# EAGLE design PowerAdapterBoard (EAGLE 6.3)
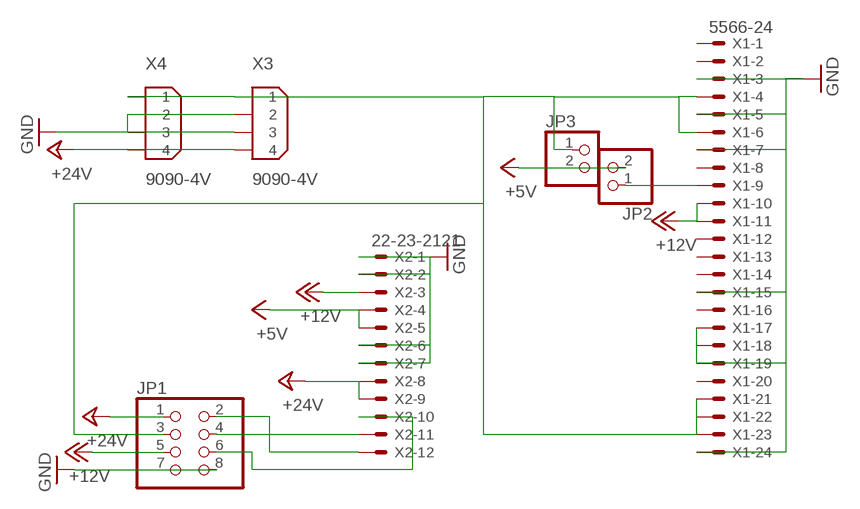
[diagram p0: schematic, sheet 1]

## Parts
JP1  PINHD-2X4  [2X04]
JP2  PINHD-1X2  [1X02]
JP3  PINHD-1X2  [1X02]
X1  5566-24  [5566-24]
X2  22-23-2121  [22-23-2121]
X3  9090-4V  [9090-4V]
X4  9090-4V  [9090-4V]

## Nets
+5V: JP2.2 JP3.2 X2.4 X2.5
+12V: JP1.5 X1.10 X1.11 X2.3
+24V: JP1.1 X2.8 X2.9 X3.4 X4.4
GND: JP1.7 JP1.8 X1.3 X1.5 X1.7 X1.15 X1.17 X1.18 X1.19 X1.24 X2.1 X2.2 X2.6 X2.7 X3.2 X3.3 X4.2 X4.3
N$1: JP1.6 X2.10
N$2: JP1.4 X2.11
N$3: JP1.2 X2.12
N$4: JP2.1 X1.9
N$5: JP1.3 JP3.1 X1.4 X1.6 X1.21 X1.22 X1.23 X3.1 X4.1
Unconnected: X1.1 X1.2 X1.8 X1.12 X1.13 X1.14 X1.16 X1.20

## Library data of the parts
JP1 = pinhead:PINHD-2X4: PIN HEADER
JP2 JP3 = pinhead:PINHD-1X2: PIN HEADER
X1 = con-molex:5566-24: Mini FIT connector 24 pol Source: http://www.molex.com; OC_FARNELL: unknown; OC_NEWARK: unknown
X2 = con-molex:22-23-2121: .100" (2.54mm) Center Header - 12 Pin; MF: MOLEX; MPN: 22-23-2121; OC_FARNELL: 1462935; OC_NEWARK: 56H0456
X3 X4 = con-thomas-betts:9090-4: Disk Drive Power four position Source: Thomas & Betts Electronic Interconnects Eiropean Edition 1998; OC_FARNELL: unknown; OC_NEWARK: unknown

## Board
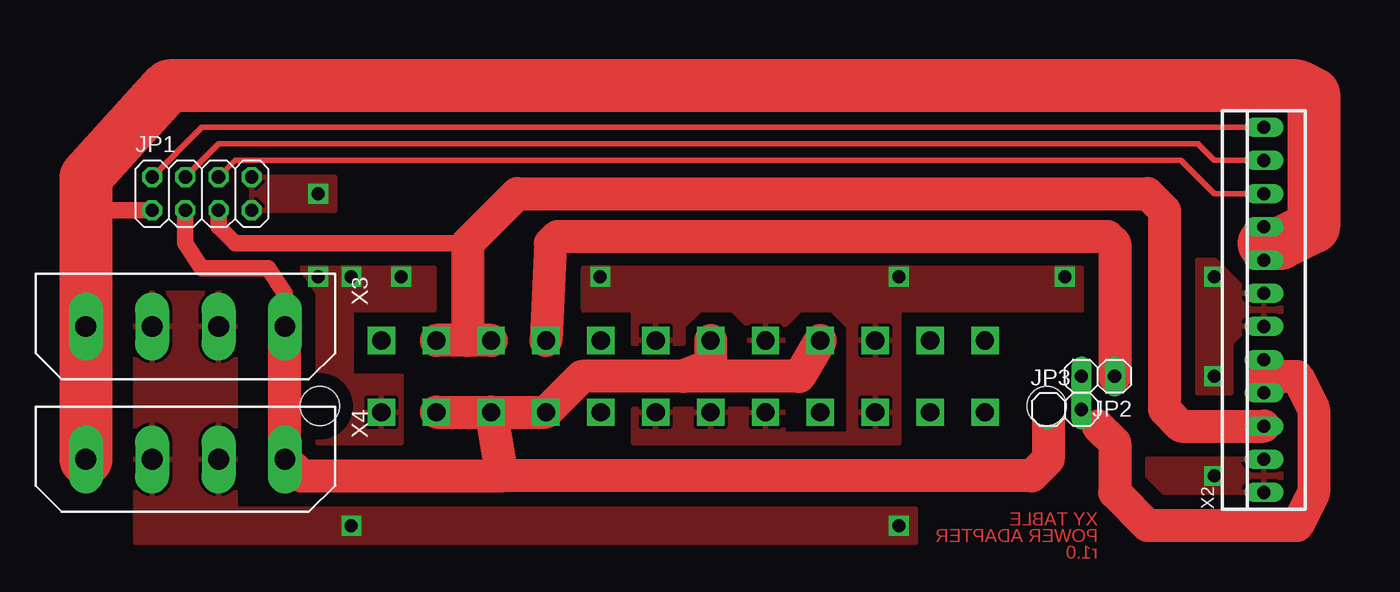
[diagram p1: board, top side]
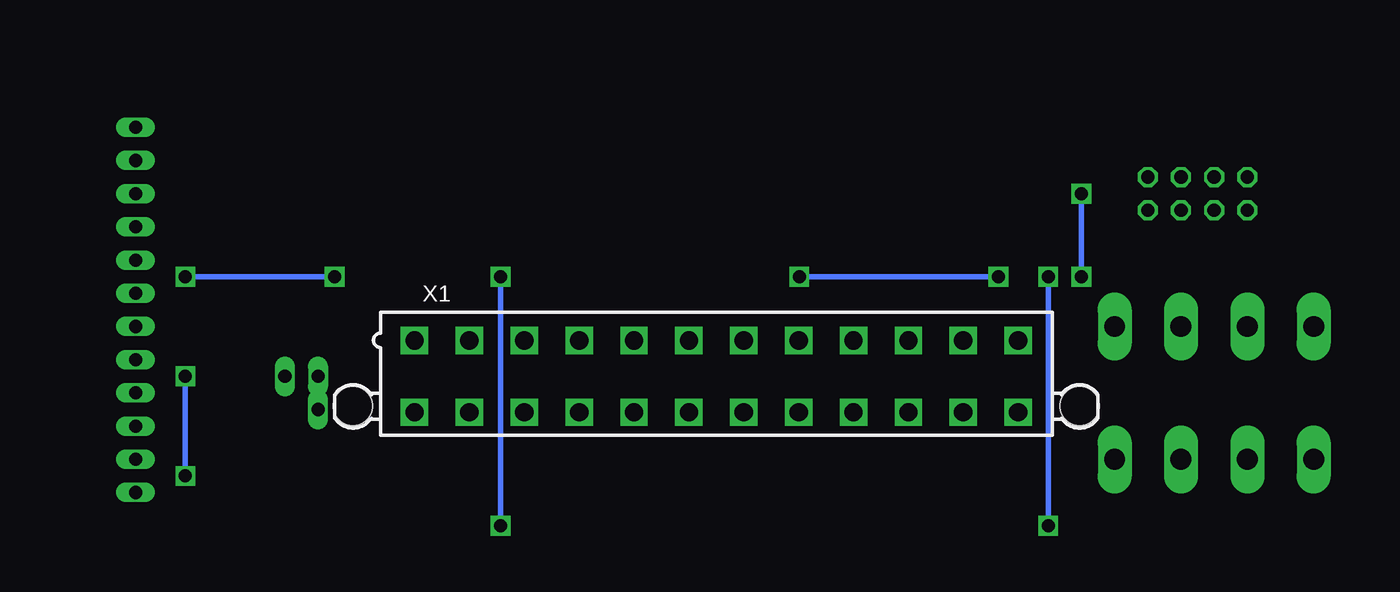
[diagram p2: board, bottom side, seen from below]

No outline drawn. Coordinates in mm, seen from the top.
Copper layers (1*16): Top 0.035mm / dielectric 1.5mm / Bottom 0.035mm
Design rules "default *": minimum track width 10mil, minimum drill 24mil, track to track 8mil, track to pad 8mil, pad to pad 8mil, via to via 8mil, smd to smd 8mil, copper to edge 40mil, drill to drill 8mil, minimum pad ring 10mil, minimum via ring 8mil, stop-mask expansion 4mil, vias tented up to drill 0mil, thermal gap 10mil

### Footprints (pad centres in the part's own frame; a part is rotated, then mirrored left to right if it is on the bottom)
2X04 = drill 1.016 octagon: 1 -3.81,-1.27; 2 -3.81,1.27; 3 -1.27,-1.27; 4 -1.27,1.27; 5 1.27,-1.27; 6 1.27,1.27; 7 3.81,-1.27; 8 3.81,1.27
1X02 = drill 1.016 long: 1 -1.27,0; 2 1.27,0
5566-24 = drill 1.4 square: 1 23.1,-2.75; 2 18.9,-2.75; 3 14.7,-2.75; 4 10.5,-2.75; 5 6.3,-2.75; 6 2.1,-2.75; 7 -2.1,-2.75; 8 -6.3,-2.75; 9 -10.5,-2.75; 10 -14.7,-2.75; 11 -18.9,-2.75; 12 -23.1,-2.75; 13 23.1,2.75; 14 18.9,2.75; 15 14.7,2.75; 16 10.5,2.75; 17 6.3,2.75; 18 2.1,2.75; 19 -2.1,2.75; 20 -6.3,2.75; 21 -10.5,2.75; 22 -14.7,2.75; 23 -18.9,2.75; 24 -23.1,2.75 | hole 3: 27.8,2.29; -27.8,2.29
22-23-2121 = drill 1 long: 1 -13.97,0; 2 -11.43,0; 3 -8.89,0; 4 -6.35,0; 5 -3.81,0; 6 -1.27,0; 7 1.27,0; 8 3.81,0; 9 6.35,0; 10 8.89,0; 11 11.43,0; 12 13.97,0
9090-4V = drill 1.6 pad 2.6 long: 1 -7.62,0; 2 -2.54,0; 3 2.54,0; 4 7.62,0

### Placement (x,y rotation side)
JP1  11.43,27.94 0 top
JP2  80.01,13.97 180 top
JP3  77.47,11.43 0 top
X1  48.26,13.97 180 bottom
X2  92.71,19.05 90 top
X3  10.16,17.78 180 top
X4  10.16,7.62 180 top

### Tracks (layer width: path | path; a pad name or v marks a point on that pad's centre or on a via)
+5V
  Top 0.406: 80.01,10.16 JP3.2
  Top 1.27: X2.4 92.71,13.97 X2.5
  Top 1.524: JP3.2 JP2.2
  Top 2.54: 92.71,13.97 95.25,13.97 96.52,11.43 96.52,5.08 95.25,2.54 83.82,2.54 81.28,5.08 81.28,8.89 80.01,10.16
+12V
  Top 1.27: JP1.5 12.7,25.4 13.97,24.13 31.75,24.13
  Top 2.54: X1.10 31.75,16.72 | 31.75,16.72 X1.11 | X2.3 86.36,10.16 85.09,11.43 85.09,26.67 83.82,27.94 35.56,27.94 31.75,24.13 31.75,16.72
+24V
  Top 0.406: X2.8 92.71,24.13 X2.9
  Top 1.27: JP1.1 2.54,26.67
  Top 4.064: X4.4 X3.4 2.54,26.67 2.54,29.21 8.89,36.2 95.25,36.2 96.52,35.56 96.52,25.4 93.98,24.13 92.71,24.13
GND  (via drill 1)
  Bottom 0.406: v26.67,21.59 v41.91,21.59 | v77.47,21.59 v88.9,21.59 | v64.77,21.59 v64.77,2.54 | v22.86,21.59 v22.86,2.54 | v88.9,6.35 v88.9,13.97 | v20.32,21.59 v20.32,27.94
  pour Top: 6.35,20.32 13.97,20.32 13.97,3.81 66.04,3.81 66.04,1.27 6.35,1.27
  pour Top: 44.45,11.43 44.45,8.89 64.77,8.89 64.77,19.05 78.74,19.05 78.74,22.23 40.64,22.23 40.64,19.05 44.45,19.05 44.45,16.51 48.26,16.51 48.26,17.78 49.53,19.05 52.07,19.05 53.34,17.78 53.34,16.51 55.88,16.51 55.88,17.78 57.15,19.05 59.69,19.05 60.96,17.78 60.96,9.53 55.88,9.53 55.88,11.43
  pour Top: 93.98,20.32 91.44,20.32 88.9,22.86 87.63,22.86 87.63,12.7 90.17,12.7 90.17,16.51 91.44,17.78 93.98,17.78
  pour Top: 93.98,7.62 93.98,5.08 85.09,5.08 83.82,6.35 83.82,7.62
  pour Top: 26.67,8.89 26.67,13.97 22.86,13.97 22.86,19.05 29.21,19.05 29.21,22.23 19.05,22.23 20.32,20.32 20.32,8.89
  pour Top: 15.24,29.21 21.59,29.21 21.59,26.67 15.24,26.67
N$1
  Top 0.406: X2.10 88.9,27.94 86.36,30.48 13.97,30.48 JP1.6
N$2
  Top 0.406: X2.11 88.9,30.48 87.63,31.75 12.7,31.75 JP1.4
N$3
  Top 0.406: JP1.2 11.43,33.02 X2.12
N$4
  Top 2.54: JP2.1 81.28,24.13 80.73,24.68 38.65,24.68 38.1,24.13 X1.9
N$5
  Top 1.27: JP1.3 10.16,24.13 11.43,22.23 16.51,22.23 17.78,20.32 X3.1
  Top 2.54: X3.1 X4.1 19.05,6.35 34.29,6.35 | X1.6 50.36,14.8 48.26,13.97 | 48.26,13.97 40.51,13.97 X1.21 X1.22 | 34.29,6.35 34.29,6.87 X1.22 | X1.23 X1.22 | X1.4 57.15,13.97 48.26,13.97 | JP3.1 76.2,7.62 74.93,6.35 34.29,6.35

### Text on the board
Top: XY TABLE | POWER ADAPTER | r1.0